# EAGLE design CCM_0024 (EAGLE 9.5.1)

## Sheet 1 of 2: rear panel
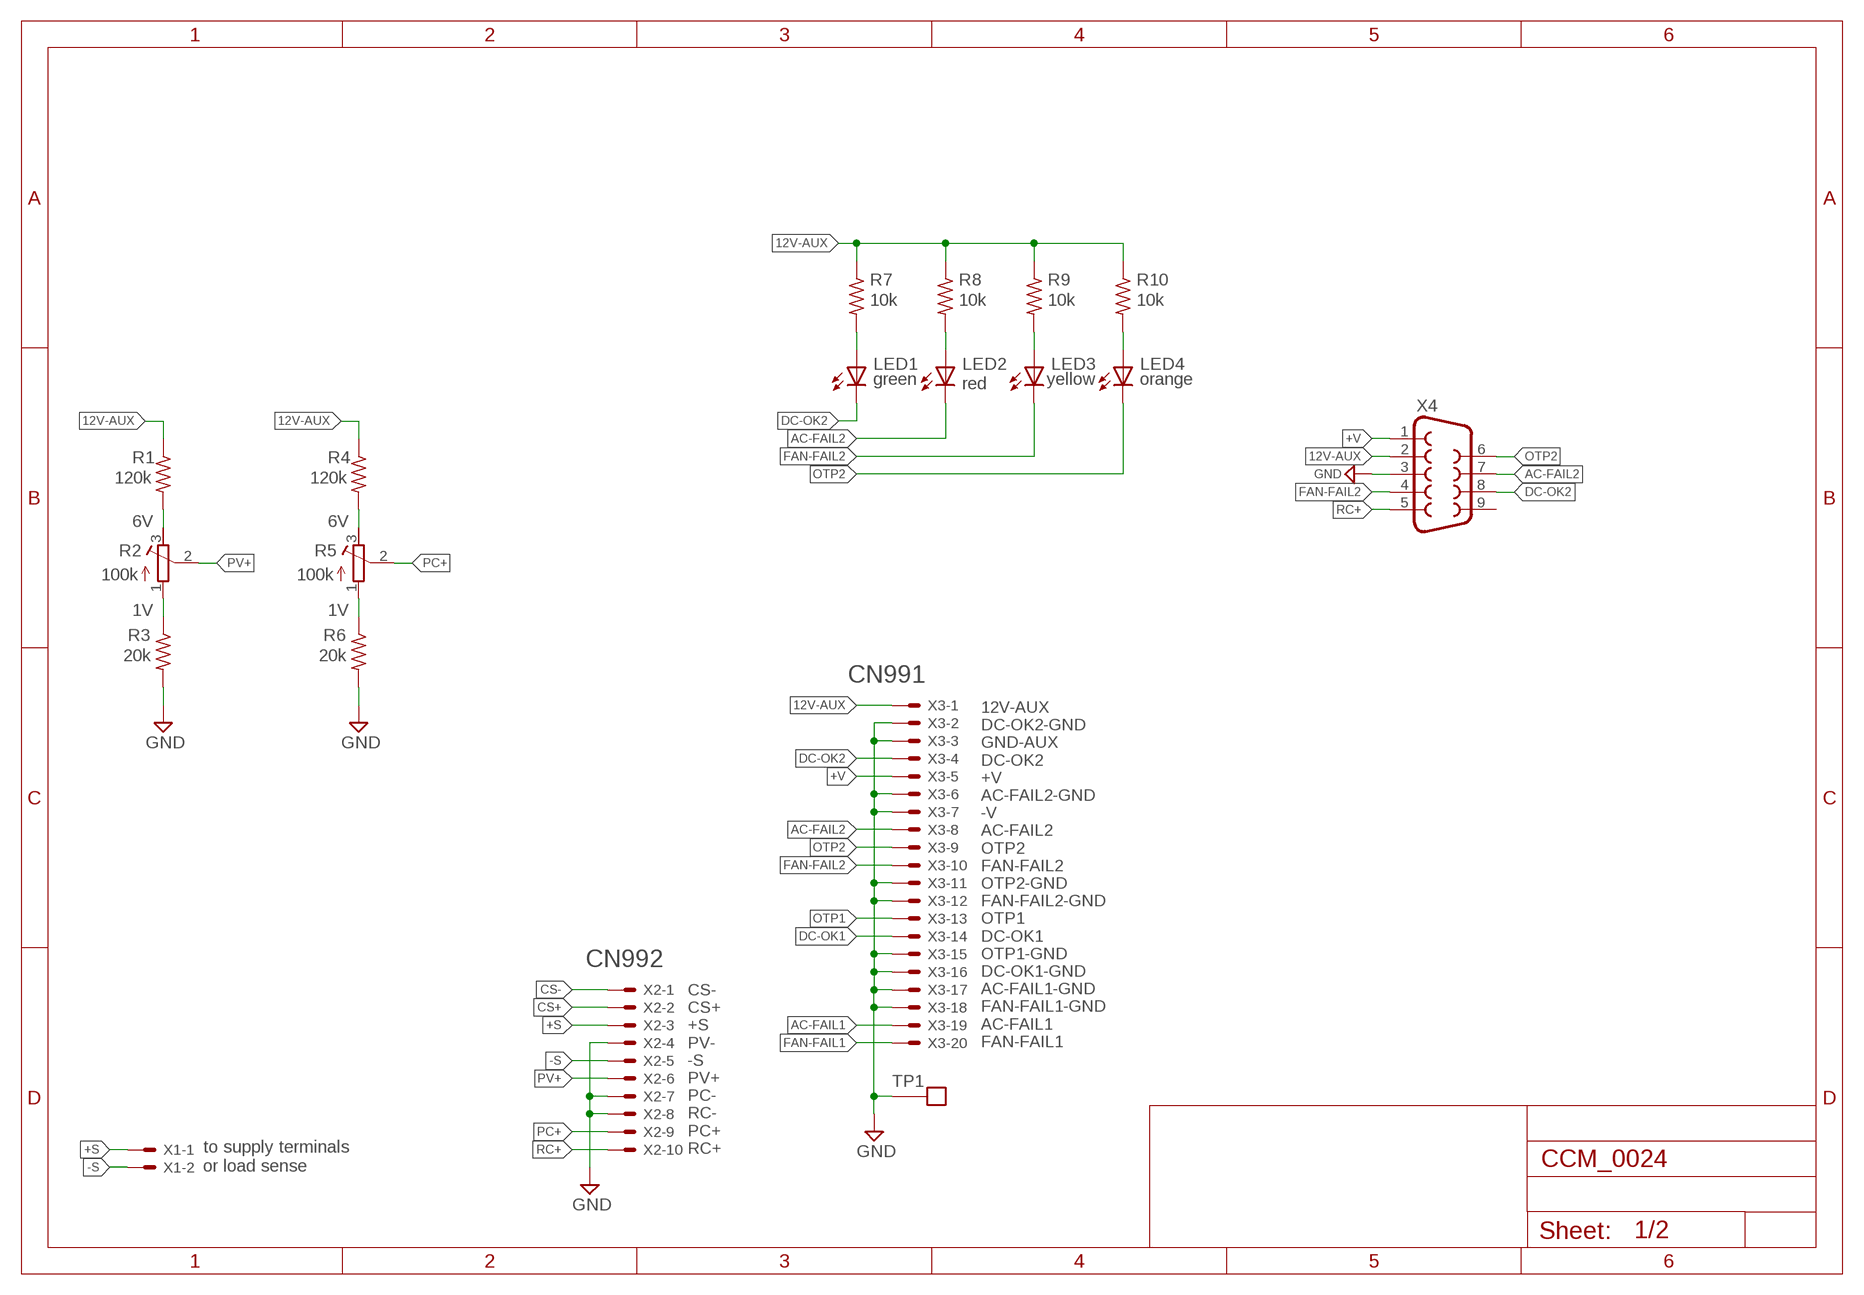
[diagram p0: schematic, sheet 1]

### Parts
LED1  green  LED_ESML0603  [LED_SML0603]
LED2  red  LED_ESML0603  [LED_SML0603]
LED3  yellow  LED_ESML0603  [LED_SML0603]
LED4  orange  LED_ESML0603  [LED_SML0603]
R1  120k  R0603  [0603]
R2  100k  R-TRIMM3296Y  [RTRIM3296Y]
R3  20k  R0603  [0603]
R4  120k  R0603  [0603]
R5  100k  R-TRIMM3296Y  [RTRIM3296Y]
R6  20k  R0603  [0603]
R7  10k  R0603  [0603]
R8  10k  R0603  [0603]
R9  10k  R0603  [0603]
R10  10k  R0603  [0603]
TP1  TESTPOINT  [TESTPOINT]
X1  22-23-2021  [22-23-2021]
X2  87758-1016  [87758-1016]
X3  87758-2016  [87758-2016]
X4  F09V  [F09V]

### Nets
12V-AUX: R1.1 R4.1 R7.1 R8.1 R9.1 R10.1 X3.1 X4.2
+S: X1.1 X2.3
+V: X3.5 X4.1
-S: X1.2 X2.5
AC-FAIL1: X3.19
AC-FAIL2: LED2.C X3.8 X4.7
CS+: X2.2
CS-: X2.1
DC-OK1: X3.14
DC-OK2: LED1.C X3.4 X4.8
FAN-FAIL1: X3.20
FAN-FAIL2: LED3.C X3.10 X4.4
GND: R3.2 R6.2 TP1.P$1 X2.4 X2.7 X2.8 X3.2 X3.3 X3.6 X3.7 X3.11 X3.12 X3.15 X3.16 X3.17 X3.18 X4.3
N$2: LED1.A R7.2
N$3: R2.1(A) R3.1
N$4: R1.2 R2.3(E)
N$19: LED2.A R8.2
N$20: LED3.A R9.2
N$21: LED4.A R10.2
N$23: R5.1(A) R6.1
N$24: R4.2 R5.3(E)
OTP1: X3.13
OTP2: LED4.C X3.9 X4.6
PC+: R5.2(S) X2.9
PV+: R2.2(S) X2.6
RC+: X2.10 X4.5
Unconnected: X4.9

### Notes on the sheet
- 6V | 6V
- 1V | 1V
- CN991
- CN992
- 12V-AUX
  DC-OK2-GND
  GND-AUX
  DC-OK2
  +V
  AC-FAIL2-GND
  -V
  AC-FAIL2
  OTP2
  FAN-FAIL2
  OTP2-GND
  FAN-FAIL2-GND
  OTP1
  DC-OK1
  OTP1-GND
  DC-OK1-GND
  AC-FAIL1-GND
  FAN-FAIL1-GND
  AC-FAIL1
  FAN-FAIL1
- CS-
  CS+
  +S
  PV-
  -S
  PV+
  PC-
  RC-
  PC+
  RC+
- to supply terminals
  or load sense

## Sheet 2 of 2: control box
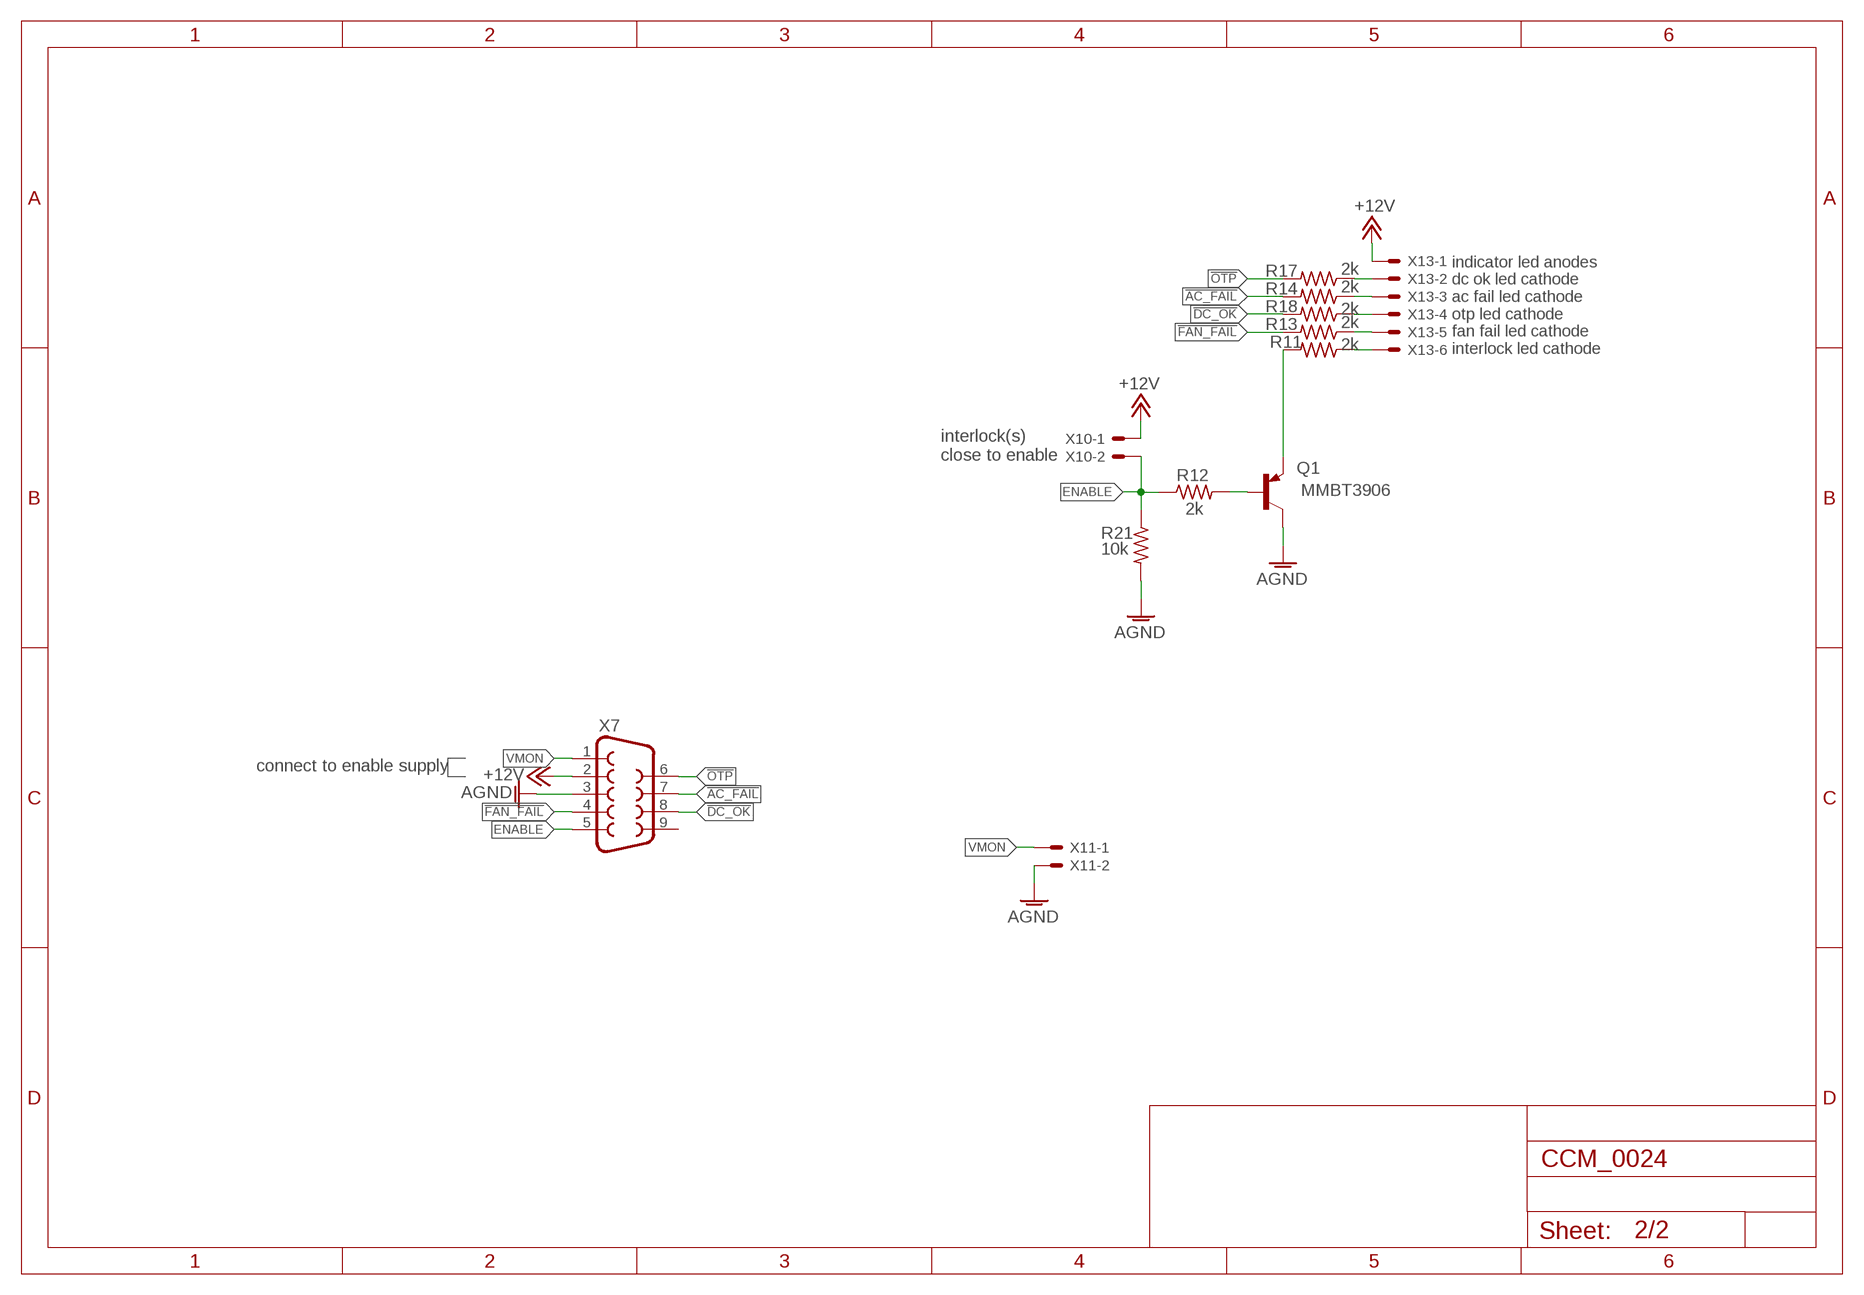
[diagram p1: schematic, sheet 2]

### Parts
Q1  MMBT3906  MMBT3906LT1SMD  [SOT23-BEC]
R11  2k  R0603  [0603]
R12  2k  R0603  [0603]
R13  2k  R0603  [0603]
R14  2k  R0603  [0603]
R17  2k  R0603  [0603]
R18  2k  R0603  [0603]
R21  10k  R0603  [0603]
X7  F09H  [F09H]
X10  22-23-2021  [22-23-2021]
X11  22-23-2021  [22-23-2021]
X13  22-23-2061  [22-23-2061]

### Nets
!AC_FAIL: R14.2 X7.7
!DC_OK: R18.2 X7.8
!FAN_FAIL: R13.2 X7.4
!OTP: R17.2 X7.6
+12V: X7.2 X10.1 X13.1
AGND: Q1.C R21.2 X7.3 X11.2
ENABLE: R12.1 R21.1 X7.5 X10.2
N$1: R11.1 X13.6
N$5: Q1.E R11.2
N$6: R17.1 X13.2
N$7: Q1.B R12.2
N$8: R14.1 X13.3
N$9: R13.1 X13.5
N$10: R18.1 X13.4
VMON: X7.1 X11.1
Unconnected: X7.9

### Notes on the sheet
- indicator led anodes
  dc ok led cathode
  ac fail led cathode
  otp led cathode
  fan fail led cathode
  interlock led cathode
- interlock(s)
  close to enable
- connect to enable supply

## Library data of the parts
LED1-LED4 = eagle-ltspice:LED_E: LED Source: http://www.osram.convergy.de Source: www.luxeon.com Source: www.kingbright.com; SPICEMODEL: NONE; SPICEPREFIX: D; SPICETYPE: diode
Q1 = transistor-pnp:MMBT3906*: PNP Transistror
R1 R3 R4 R6-R14 R17 R18 R21 = acrooptics:R: 0603 resistor
R2 R5 = resistor:R-TRIMM: Trimm resistor
TP1 = noah:TESTPOINT
X1 X10 X11 = con-molex:22-23-2021: .100" (2.54mm) Center Header - 2 Pin; MF: MOLEX; MPN: 22-23-2021; OC_FARNELL: 1462926; OC_NEWARK: 25C3832
X2 = con-molex:87758-1016: 10 Pin - 2mm Dual Row Single Wafer, Vertical T/H HDR Source: http://www.molex.com/pdm_docs/sd/877580616_sd.pdf; MF: MOLEX; MPN: 87758-1016; OC_FARNELL: 7472340; OC_NEWARK: 59J1558
X3 = con-molex:87758-2016: 20 Pin - 2mm Dual Row Single Wafer, Vertical T/H HDR Source: http://www.molex.com/pdm_docs/sd/877580616_sd.pdf; MF: MOLEX; MPN: 87758-2016; OC_FARNELL: 7472374; OC_NEWARK: 25M5677
X4 X7 = con-subd:F09: SUB-D; OC_FARNELL: unknown; OC_NEWARK: unknown
X13 = con-molex:22-23-2061: .100" (2.54mm) Center Header - 6 Pin; MF: MOLEX; MPN: 22-23-2061; OC_FARNELL: 1462922; OC_NEWARK: 27C1933

## Net classes
1 standard: width 0.61 mm, clearance 0.254 mm

## Board
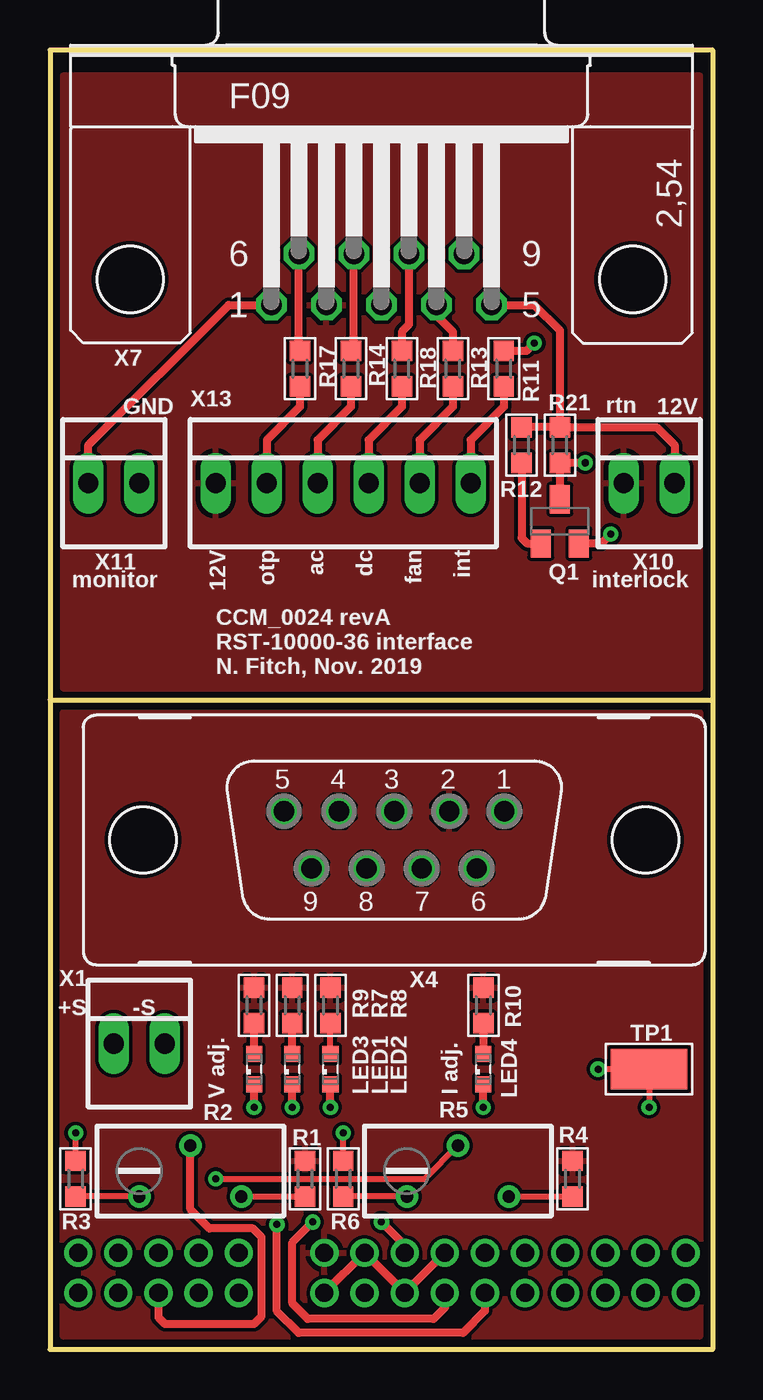
[diagram p2: board, top side]
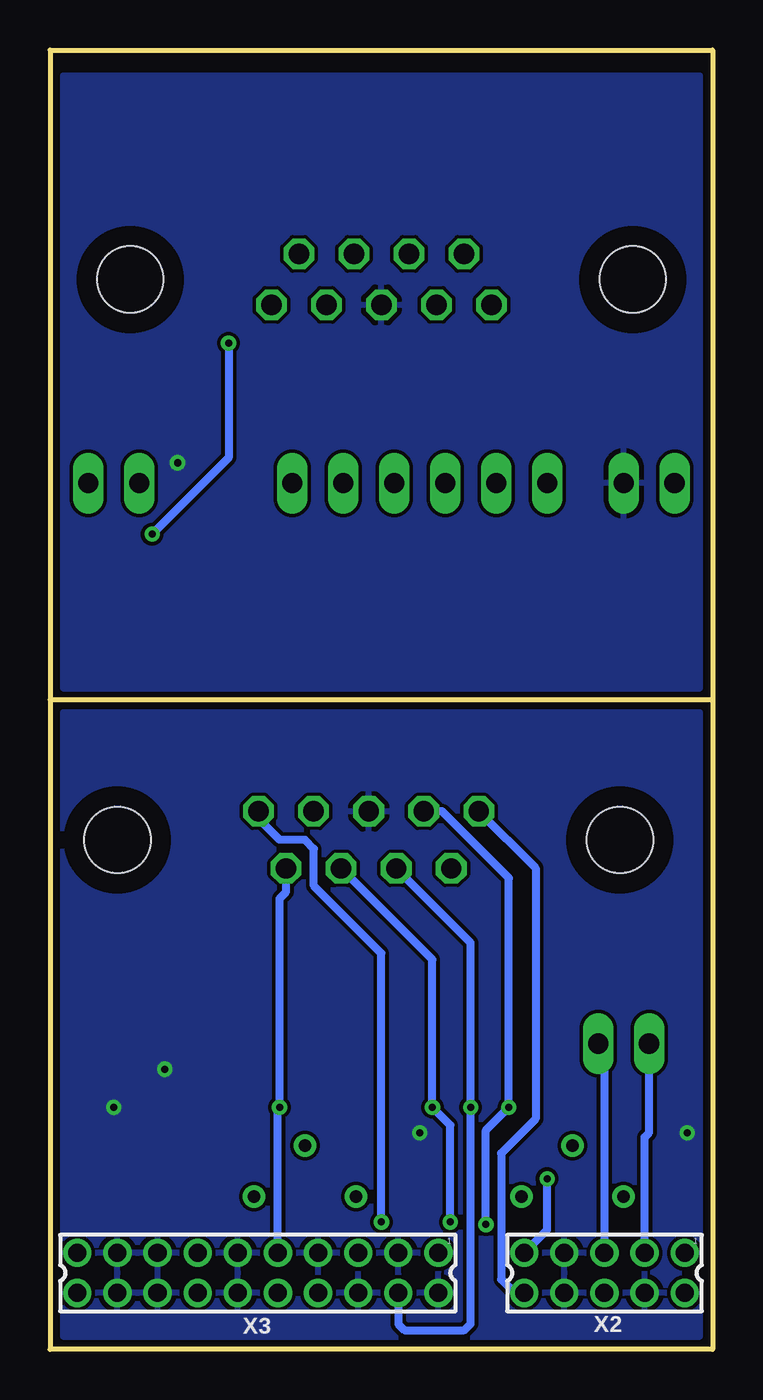
[diagram p3: board, bottom side, seen from below]

Size 33.02 x 64.77 mm. Coordinates in mm from the lower left corner, seen from the top.
Outline: 0,32.38 0,64.77 33.02,64.77 33.02,32.38
Outline: 0,32.38 0,0 33.02,0 33.02,32.38
Outline: 0,32.38 33.02,32.38
Copper layers (1*16): Top 0.035mm / dielectric 1.5mm / Bottom 0.035mm
Design rules "default *": minimum track width 10mil, minimum drill 10mil, track to track 7mil, track to pad 7mil, pad to pad 7mil, via to via 7mil, smd to smd 7mil, copper to edge 10mil, drill to drill 8mil, minimum pad ring 10mil, minimum via ring 8mil, stop-mask expansion 4mil, vias tented up to drill 0mil, thermal gap 10mil

### Footprints (pad centres in the part's own frame; a part is rotated, then mirrored left to right if it is on the bottom)
LED_SML0603 = smd 0.8 x 0.8: A 0.75,0; C -0.75,0
SOT23-BEC = smd 1 x 1.4: B -0.95,-1.1; C 0,1.1; E 0.95,-1.1
0603 = smd 1.016 x 1.016: 1 -0.889,0; 2 0.889,0
RTRIM3296Y = drill 0.61: 1 1.27,-2.54; 2 -1.27,0; 3 1.27,2.54
TESTPOINT = smd 3.81 x 2.032: P$1 0,0
22-23-2021 = drill 1 long: 1 -1.27,0; 2 1.27,0
87758-1016 = drill 0.9 pad 1.27: 1 -4,-1; 2 -4,1; 3 -2,-1; 4 -2,1; 5 0,-1; 6 0,1; 7 2,-1; 8 2,1; 9 4,-1; 10 4,1
87758-2016 = drill 0.9 pad 1.27: 1 -9,-1; 2 -9,1; 3 -7,-1; 4 -7,1; 5 -5,-1; 6 -5,1; 7 -3,-1; 8 -3,1; 9 -1,-1; 10 -1,1; 11 1,-1; 12 1,1; 13 3,-1; 14 3,1; 15 5,-1; 16 5,1; 17 7,-1; 18 7,1; 19 9,-1; 20 9,1
F09V = drill 1.016 octagon: 1 5.486,1.422; 2 2.743,1.422; 3 0,1.422; 4 -2.743,1.422; 5 -5.486,1.422; 6 4.115,-1.422; 7 1.372,-1.422; 8 -1.372,-1.422; 9 -4.115,-1.422 | hole 3.302: -12.522,0; 12.522,0
F09H = drill 1.016 octagon: 1 -5.486,-1.27; 2 -2.743,-1.27; 3 0,-1.27; 4 2.743,-1.27; 5 5.486,-1.27; 6 -4.115,1.27; 7 -1.372,1.27; 8 1.372,1.27; 9 4.115,1.27 | hole 3.302: -12.522,0; 12.522,0
22-23-2061 = drill 1 long: 1 -6.35,0; 2 -3.81,0; 3 -1.27,0; 4 1.27,0; 5 3.81,0; 6 6.35,0

### Placement (x,y rotation side)
LED1  12.06,13.97 90 top
LED2  13.97,13.97 90 top
LED3  10.16,13.97 90 top
LED4  21.59,13.97 90 top
Q1  25.4,41.27 0 top
R1  12.7,8.51 270 top
R2  6.99,8.89 270 top
R3  1.27,8.51 90 top
R4  26.04,8.51 270 top
R5  20.32,8.89 270 top
R6  14.61,8.51 90 top
R7  12.06,17.14 270 top
R8  13.97,17.14 270 top
R9  10.16,17.14 270 top
R10  21.59,17.14 270 top
R11  22.61,48.9 90 top
R12  23.5,45.09 270 top
R13  20.07,48.9 90 top
R14  14.99,48.9 90 top
R17  12.45,48.9 90 top
R18  17.53,48.9 90 top
R21  25.4,45.09 270 top
TP1  29.84,13.97 0 top
X1  4.45,15.24 0 top
X2  5.4,3.81 180 bottom
X3  22.67,3.81 180 bottom
X4  17.14,25.4 0 top
X7  16.51,53.34 0 top
X10  29.84,43.18 0 top
X11  3.17,43.18 0 top
X13  14.61,43.18 0 top

### Tracks (layer width: path | path; a pad name or v marks a point on that pad's centre or on a via)
12V-AUX
  pour Top: 0.64,0.64 0.64,31.75 32.38,31.75 32.38,0.64
!AC_FAIL
  Top 0.406: R14.2 15.14,49.94 X7.7
!DC_OK
  Top 0.406: X7.8 17.88,51.09 17.53,50.74 R18.2
!FAN_FAIL
  Top 0.406: X7.4 19.25,51.55 20.07,50.74 R13.2
!OTP
  Top 0.406: R17.2 12.38,49.78 12.38,54.6 X7.6
+12V
  pour Top: 32.38,63.5 0.64,63.5 0.64,32.96 32.38,32.96
+S
  Bottom 0.406: X2.3 3.4,10.57 3.17,10.79 X1.1
+V  (via drill 0.35)
  Top 0.406: X3.5 17.67,5.19 v16.51,6.35
  Bottom 0.406: v16.51,6.35 16.51,19.75 19.88,23.11 19.88,24.96 20.32,25.4 21.59,25.4 22.63,26.44 X4.1
-S
  Bottom 0.406: X1.2 5.4,14.92 X2.5
AC-FAIL2  (via drill 0.35)
  Top 0.406: X3.8 19.67,2.08 19.11,1.52 12.83,1.52 12.06,2.29 12.06,5.33 v13.08,6.35 | v13.97,12.06 LED2.C
  Bottom 0.406: v13.08,6.35 13.08,11.18 v13.97,12.06 13.97,19.43 X4.7
AGND  (via drill 0.35)
  Top 0.406: Q1.C R21.2 v26.67,44.2
  pour Bottom: 0.64,32.96 0.64,63.5 32.38,63.5 32.38,32.96
DC-OK2  (via drill 0.35)
  Top 0.406: v12.06,12.06 LED1.C
  Bottom 0.406: X3.4 15.67,1.25 15.37,0.95 12.38,0.95 12.06,1.27 v12.06,12.06 12.06,20.27 X4.8
ENABLE
  Top 0.406: R21.1 30.23,45.97 31.11,45.09 X10.2 | X7.5 24.13,52.07 25.4,50.8 R21.1 | R21.1 R12.1
FAN-FAIL2  (via drill 0.35)
  Top 0.406: X3.10 21.67,1.92 20.57,0.83 12.38,0.83 11.3,1.91 v11.3,6.22 | v10.16,12.06 LED3.C
  Bottom 0.406: v11.3,6.22 11.3,10.92 v10.16,12.06 10.16,23.5 13.49,26.82 X4.4
GND  (via drill 0.35)
  Top 0.305: R3.2 v1.27,10.79 | R6.2 v14.61,10.79 | v29.84,12.06 TP1.P$1 v27.3,13.97
  Top 0.406: X3.2 X3.3 X3.6 X3.7
  pour Bottom: 0.64,0.64 0.64,31.75 32.38,31.75 32.38,0.64
N$1
  Top 0.406: R11.1 22.61,46.99 20.95,45.34 X13.6
N$2
  Top 0.406: LED1.A R7.2
N$3
  Top 0.305: R2.1 R3.1
N$4
  Top 0.305: R2.3 R1.2
N$5  (via drill 0.35)
  Top 0.406: R11.2 23.75,49.78 v24.13,50.16 | v27.94,40.64 27.48,40.17 Q1.E
  Bottom 0.406: v24.13,50.16 24.13,44.45 v27.94,40.64
N$6
  Top 0.406: R17.1 12.45,46.99 10.79,45.34 X13.2
N$7
  Top 0.406: R12.2 23.5,40.45 23.77,40.17 Q1.B
N$8
  Top 0.406: R14.1 14.99,46.99 13.34,45.34 X13.3
N$9
  Top 0.406: R13.1 20.07,46.99 18.41,45.34 X13.5
N$10
  Top 0.406: R18.1 17.53,46.99 15.88,45.34 X13.4
N$19
  Top 0.305: LED2.A R8.2
N$20
  Top 0.406: LED3.A R9.2
N$21
  Top 0.406: R10.2 LED4.A
N$23
  Top 0.305: R5.1 R6.1
N$24
  Top 0.305: R5.3 R4.2
OTP2  (via drill 0.35)
  Top 0.406: v21.59,12.06 LED4.C
  Bottom 0.406: X3.9 21.67,11.99 v21.59,12.06 21.59,22.48 21.26,22.81 X4.6
PC+  (via drill 0.35)
  Top 0.305: R5.2 18.67,8.51 v8.26,8.51
  Bottom 0.406: X2.9 8.26,5.95 v8.26,8.51
PV+
  Top 0.406: X2.6 5.4,1.59 5.71,1.27 10.16,1.27 10.54,1.65 10.54,5.59 10.1,6.03 7.94,6.03 6.99,6.99 R2.2
RC+
  Bottom 0.406: X2.10 9.86,2.81 10.54,3.49 10.54,9.78 8.83,11.49 8.83,23.99 X4.5
VMON
  Top 0.406: X11.1 1.91,45.09 8.89,52.07 X7.1

### Text on the board
tPlace: GND | rtn | 12V | 12V / / otp / / ac / / dc / / fan / / int | monitor | interlock | CCM_0024 revA / RST-10000-36 interface / N. Fitch, Nov. 2019 | +S -S | V adj. | I adj.